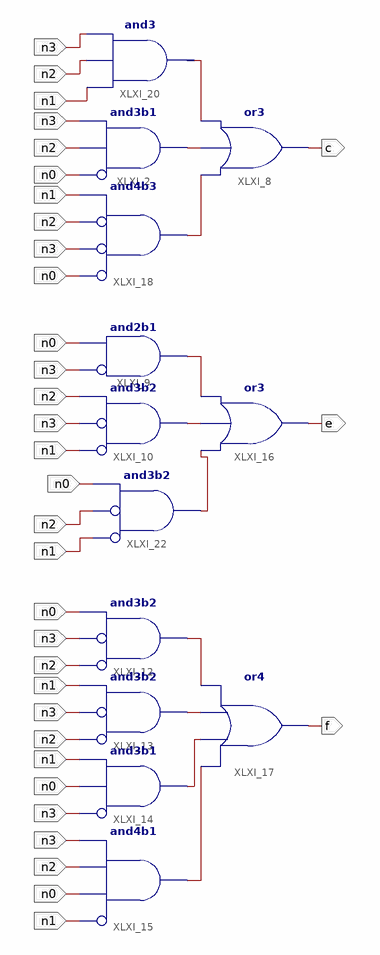
[diagram p0: schematic sheet 1]
// Xilinx ISE schematic cef.sch (spartan3e) as structural Verilog: 13 symbols, 7 ports
module cef (
  input  n0,
  input  n1,
  input  n3,
  input  n2,
  output e,
  output f,
  output c
);

  wire XLXN_1, XLXN_2, XLXN_3, XLXN_4, XLXN_5, XLXN_6, XLXN_7, XLXN_8, XLXN_9, XLXN_10;

  and XLXI_2 (XLXN_1, ~n0, n2, n3);  // and3b1
  or XLXI_8 (c, XLXN_3, XLXN_1, XLXN_2);
  and XLXI_9 (XLXN_6, ~n3, n0);  // and2b1
  and XLXI_10 (XLXN_4, ~n1, ~n3, n2);  // and3b2
  and XLXI_12 (XLXN_8, ~n2, ~n3, n0);  // and3b2
  and XLXI_13 (XLXN_5, ~n2, ~n3, n1);  // and3b2
  and XLXI_14 (XLXN_9, ~n3, n0, n1);  // and3b1
  and XLXI_15 (XLXN_10, ~n1, n0, n2, n3);  // and4b1
  or XLXI_16 (e, XLXN_7, XLXN_4, XLXN_6);
  or XLXI_17 (f, XLXN_10, XLXN_9, XLXN_5, XLXN_8);
  and XLXI_18 (XLXN_3, ~n0, ~n3, ~n2, n1);  // and4b3
  and XLXI_20 (XLXN_2, n1, n2, n3);
  and XLXI_22 (XLXN_7, ~n1, ~n2, n0);  // and3b2
endmodule
